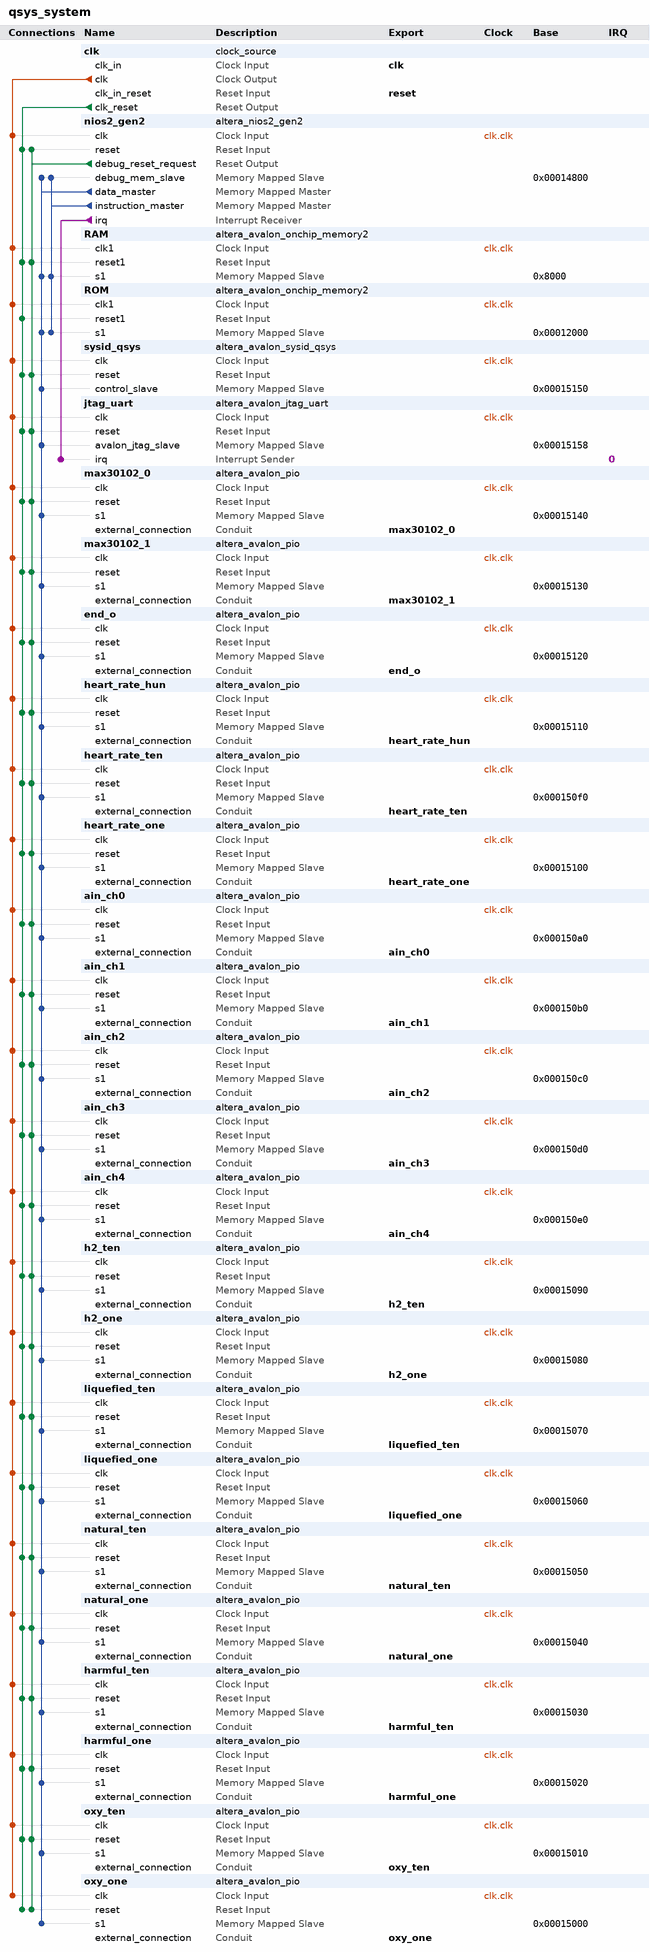
[diagram p0: system contents]
# Platform Designer (Qsys) system qsys_system, Cyclone IV E EP4CE10F17C8
# Parameters at their usual value, and those the tool derives, are not listed.
package require -exact qsys 18.1
create_system qsys_system
set_project_property DEVICE_FAMILY {Cyclone IV E}
set_project_property DEVICE EP4CE10F17C8

add_instance clk clock_source 18.1
set_instance_parameter_value clk clockFrequency 50000000

add_instance nios2_gen2 altera_nios2_gen2 18.1
set_instance_parameter_value nios2_gen2 dcache_size 2048
set_instance_parameter_value nios2_gen2 exceptionSlave RAM.s1
set_instance_parameter_value nios2_gen2 icache_size 4096
set_instance_parameter_value nios2_gen2 impl Tiny
set_instance_parameter_value nios2_gen2 resetSlave ROM.s1

add_instance RAM altera_avalon_onchip_memory2 18.1
set_instance_parameter_value RAM dataWidth 32
set_instance_parameter_value RAM dualPort false
set_instance_parameter_value RAM initMemContent true
set_instance_parameter_value RAM initializationFileName E:/2019GEDC/CODE_Project/Cyclone_IV/FAMS/software/Data_Process/mem_init/qsys_system_RAM.hex
set_instance_parameter_value RAM memorySize 20480
set_instance_parameter_value RAM useNonDefaultInitFile true

add_instance ROM altera_avalon_onchip_memory2 18.1
set_instance_parameter_value ROM dataWidth 32
set_instance_parameter_value ROM dualPort false
set_instance_parameter_value ROM initMemContent true
set_instance_parameter_value ROM initializationFileName E:/2019GEDC/CODE_Project/Cyclone_IV/FAMS/software/Data_Process/mem_init/qsys_system_ROM.hex
set_instance_parameter_value ROM memorySize 8192
set_instance_parameter_value ROM useNonDefaultInitFile true
set_instance_parameter_value ROM writable false

add_instance sysid_qsys altera_avalon_sysid_qsys 18.1
set_instance_parameter_value sysid_qsys id 0

add_instance jtag_uart altera_avalon_jtag_uart 18.1
set_instance_parameter_value jtag_uart simInteractiveOptions NO_INTERACTIVE_WINDOWS

add_instance max30102_0 altera_avalon_pio 18.1
set_instance_parameter_value max30102_0 direction Input
set_instance_parameter_value max30102_0 width 24

add_instance max30102_1 altera_avalon_pio 18.1
set_instance_parameter_value max30102_1 direction Input
set_instance_parameter_value max30102_1 width 24

add_instance end_o altera_avalon_pio 18.1
set_instance_parameter_value end_o direction Input
set_instance_parameter_value end_o width 1

add_instance heart_rate_hun altera_avalon_pio 18.1
set_instance_parameter_value heart_rate_hun direction Output
set_instance_parameter_value heart_rate_hun width 4

add_instance heart_rate_ten altera_avalon_pio 18.1
set_instance_parameter_value heart_rate_ten direction Output
set_instance_parameter_value heart_rate_ten width 4

add_instance heart_rate_one altera_avalon_pio 18.1
set_instance_parameter_value heart_rate_one direction Output
set_instance_parameter_value heart_rate_one width 4

add_instance ain_ch0 altera_avalon_pio 18.1
set_instance_parameter_value ain_ch0 direction Input
set_instance_parameter_value ain_ch0 width 12

add_instance ain_ch1 altera_avalon_pio 18.1
set_instance_parameter_value ain_ch1 direction Input
set_instance_parameter_value ain_ch1 width 12

add_instance ain_ch2 altera_avalon_pio 18.1
set_instance_parameter_value ain_ch2 direction Input
set_instance_parameter_value ain_ch2 width 12

add_instance ain_ch3 altera_avalon_pio 18.1
set_instance_parameter_value ain_ch3 direction Input
set_instance_parameter_value ain_ch3 width 12

add_instance ain_ch4 altera_avalon_pio 18.1
set_instance_parameter_value ain_ch4 direction Input
set_instance_parameter_value ain_ch4 width 12

add_instance h2_ten altera_avalon_pio 18.1
set_instance_parameter_value h2_ten direction Output
set_instance_parameter_value h2_ten width 4

add_instance h2_one altera_avalon_pio 18.1
set_instance_parameter_value h2_one direction Output
set_instance_parameter_value h2_one width 4

add_instance liquefied_ten altera_avalon_pio 18.1
set_instance_parameter_value liquefied_ten direction Output
set_instance_parameter_value liquefied_ten width 4

add_instance liquefied_one altera_avalon_pio 18.1
set_instance_parameter_value liquefied_one direction Output
set_instance_parameter_value liquefied_one width 4

add_instance natural_ten altera_avalon_pio 18.1
set_instance_parameter_value natural_ten direction Output
set_instance_parameter_value natural_ten width 4

add_instance natural_one altera_avalon_pio 18.1
set_instance_parameter_value natural_one direction Output
set_instance_parameter_value natural_one width 4

add_instance harmful_ten altera_avalon_pio 18.1
set_instance_parameter_value harmful_ten direction Output
set_instance_parameter_value harmful_ten width 4

add_instance harmful_one altera_avalon_pio 18.1
set_instance_parameter_value harmful_one direction Output
set_instance_parameter_value harmful_one width 4

add_instance oxy_ten altera_avalon_pio 18.1
set_instance_parameter_value oxy_ten direction Output
set_instance_parameter_value oxy_ten width 4

add_instance oxy_one altera_avalon_pio 18.1
set_instance_parameter_value oxy_one direction Output
set_instance_parameter_value oxy_one width 4

# connections
add_connection clk.clk ain_ch0.clk clock
add_connection clk.clk ain_ch1.clk clock
add_connection clk.clk ain_ch2.clk clock
add_connection clk.clk ain_ch3.clk clock
add_connection clk.clk ain_ch4.clk clock
add_connection clk.clk end_o.clk clock
add_connection clk.clk h2_one.clk clock
add_connection clk.clk h2_ten.clk clock
add_connection clk.clk harmful_one.clk clock
add_connection clk.clk harmful_ten.clk clock
add_connection clk.clk heart_rate_hun.clk clock
add_connection clk.clk heart_rate_one.clk clock
add_connection clk.clk heart_rate_ten.clk clock
add_connection clk.clk jtag_uart.clk clock
add_connection clk.clk liquefied_one.clk clock
add_connection clk.clk liquefied_ten.clk clock
add_connection clk.clk max30102_0.clk clock
add_connection clk.clk max30102_1.clk clock
add_connection clk.clk natural_one.clk clock
add_connection clk.clk natural_ten.clk clock
add_connection clk.clk nios2_gen2.clk clock
add_connection clk.clk oxy_one.clk clock
add_connection clk.clk oxy_ten.clk clock
add_connection clk.clk RAM.clk1 clock
add_connection clk.clk ROM.clk1 clock
add_connection clk.clk sysid_qsys.clk clock
add_connection clk.clk_reset ain_ch0.reset reset
add_connection clk.clk_reset ain_ch1.reset reset
add_connection clk.clk_reset ain_ch2.reset reset
add_connection clk.clk_reset ain_ch3.reset reset
add_connection clk.clk_reset ain_ch4.reset reset
add_connection clk.clk_reset end_o.reset reset
add_connection clk.clk_reset h2_one.reset reset
add_connection clk.clk_reset h2_ten.reset reset
add_connection clk.clk_reset harmful_one.reset reset
add_connection clk.clk_reset harmful_ten.reset reset
add_connection clk.clk_reset heart_rate_hun.reset reset
add_connection clk.clk_reset heart_rate_one.reset reset
add_connection clk.clk_reset heart_rate_ten.reset reset
add_connection clk.clk_reset jtag_uart.reset reset
add_connection clk.clk_reset liquefied_one.reset reset
add_connection clk.clk_reset liquefied_ten.reset reset
add_connection clk.clk_reset max30102_0.reset reset
add_connection clk.clk_reset max30102_1.reset reset
add_connection clk.clk_reset natural_one.reset reset
add_connection clk.clk_reset natural_ten.reset reset
add_connection clk.clk_reset nios2_gen2.reset reset
add_connection clk.clk_reset oxy_one.reset reset
add_connection clk.clk_reset oxy_ten.reset reset
add_connection clk.clk_reset RAM.reset1 reset
add_connection clk.clk_reset ROM.reset1 reset
add_connection clk.clk_reset sysid_qsys.reset reset
add_connection nios2_gen2.debug_reset_request ain_ch0.reset reset
add_connection nios2_gen2.debug_reset_request ain_ch1.reset reset
add_connection nios2_gen2.debug_reset_request ain_ch2.reset reset
add_connection nios2_gen2.debug_reset_request ain_ch3.reset reset
add_connection nios2_gen2.debug_reset_request ain_ch4.reset reset
add_connection nios2_gen2.debug_reset_request end_o.reset reset
add_connection nios2_gen2.debug_reset_request h2_one.reset reset
add_connection nios2_gen2.debug_reset_request h2_ten.reset reset
add_connection nios2_gen2.debug_reset_request harmful_one.reset reset
add_connection nios2_gen2.debug_reset_request harmful_ten.reset reset
add_connection nios2_gen2.debug_reset_request heart_rate_hun.reset reset
add_connection nios2_gen2.debug_reset_request heart_rate_one.reset reset
add_connection nios2_gen2.debug_reset_request heart_rate_ten.reset reset
add_connection nios2_gen2.debug_reset_request jtag_uart.reset reset
add_connection nios2_gen2.debug_reset_request liquefied_one.reset reset
add_connection nios2_gen2.debug_reset_request liquefied_ten.reset reset
add_connection nios2_gen2.debug_reset_request max30102_0.reset reset
add_connection nios2_gen2.debug_reset_request max30102_1.reset reset
add_connection nios2_gen2.debug_reset_request natural_one.reset reset
add_connection nios2_gen2.debug_reset_request natural_ten.reset reset
add_connection nios2_gen2.debug_reset_request nios2_gen2.reset reset
add_connection nios2_gen2.debug_reset_request oxy_one.reset reset
add_connection nios2_gen2.debug_reset_request oxy_ten.reset reset
add_connection nios2_gen2.debug_reset_request RAM.reset1 reset
add_connection nios2_gen2.debug_reset_request sysid_qsys.reset reset
add_connection nios2_gen2.data_master ain_ch0.s1 avalon
set_connection_parameter_value nios2_gen2.data_master/ain_ch0.s1 baseAddress 0x000150a0
add_connection nios2_gen2.data_master ain_ch1.s1 avalon
set_connection_parameter_value nios2_gen2.data_master/ain_ch1.s1 baseAddress 0x000150b0
add_connection nios2_gen2.data_master ain_ch2.s1 avalon
set_connection_parameter_value nios2_gen2.data_master/ain_ch2.s1 baseAddress 0x000150c0
add_connection nios2_gen2.data_master ain_ch3.s1 avalon
set_connection_parameter_value nios2_gen2.data_master/ain_ch3.s1 baseAddress 0x000150d0
add_connection nios2_gen2.data_master ain_ch4.s1 avalon
set_connection_parameter_value nios2_gen2.data_master/ain_ch4.s1 baseAddress 0x000150e0
add_connection nios2_gen2.data_master end_o.s1 avalon
set_connection_parameter_value nios2_gen2.data_master/end_o.s1 baseAddress 0x00015120
add_connection nios2_gen2.data_master h2_one.s1 avalon
set_connection_parameter_value nios2_gen2.data_master/h2_one.s1 baseAddress 0x00015080
add_connection nios2_gen2.data_master h2_ten.s1 avalon
set_connection_parameter_value nios2_gen2.data_master/h2_ten.s1 baseAddress 0x00015090
add_connection nios2_gen2.data_master harmful_one.s1 avalon
set_connection_parameter_value nios2_gen2.data_master/harmful_one.s1 baseAddress 0x00015020
add_connection nios2_gen2.data_master harmful_ten.s1 avalon
set_connection_parameter_value nios2_gen2.data_master/harmful_ten.s1 baseAddress 0x00015030
add_connection nios2_gen2.data_master heart_rate_hun.s1 avalon
set_connection_parameter_value nios2_gen2.data_master/heart_rate_hun.s1 baseAddress 0x00015110
add_connection nios2_gen2.data_master heart_rate_one.s1 avalon
set_connection_parameter_value nios2_gen2.data_master/heart_rate_one.s1 baseAddress 0x00015100
add_connection nios2_gen2.data_master heart_rate_ten.s1 avalon
set_connection_parameter_value nios2_gen2.data_master/heart_rate_ten.s1 baseAddress 0x000150f0
add_connection nios2_gen2.data_master jtag_uart.avalon_jtag_slave avalon
set_connection_parameter_value nios2_gen2.data_master/jtag_uart.avalon_jtag_slave baseAddress 0x00015158
add_connection nios2_gen2.data_master liquefied_one.s1 avalon
set_connection_parameter_value nios2_gen2.data_master/liquefied_one.s1 baseAddress 0x00015060
add_connection nios2_gen2.data_master liquefied_ten.s1 avalon
set_connection_parameter_value nios2_gen2.data_master/liquefied_ten.s1 baseAddress 0x00015070
add_connection nios2_gen2.data_master max30102_0.s1 avalon
set_connection_parameter_value nios2_gen2.data_master/max30102_0.s1 baseAddress 0x00015140
add_connection nios2_gen2.data_master max30102_1.s1 avalon
set_connection_parameter_value nios2_gen2.data_master/max30102_1.s1 baseAddress 0x00015130
add_connection nios2_gen2.data_master natural_one.s1 avalon
set_connection_parameter_value nios2_gen2.data_master/natural_one.s1 baseAddress 0x00015040
add_connection nios2_gen2.data_master natural_ten.s1 avalon
set_connection_parameter_value nios2_gen2.data_master/natural_ten.s1 baseAddress 0x00015050
add_connection nios2_gen2.data_master nios2_gen2.debug_mem_slave avalon
set_connection_parameter_value nios2_gen2.data_master/nios2_gen2.debug_mem_slave baseAddress 0x00014800
add_connection nios2_gen2.data_master oxy_one.s1 avalon
set_connection_parameter_value nios2_gen2.data_master/oxy_one.s1 baseAddress 0x00015000
add_connection nios2_gen2.data_master oxy_ten.s1 avalon
set_connection_parameter_value nios2_gen2.data_master/oxy_ten.s1 baseAddress 0x00015010
add_connection nios2_gen2.data_master RAM.s1 avalon
set_connection_parameter_value nios2_gen2.data_master/RAM.s1 baseAddress 0x8000
add_connection nios2_gen2.data_master ROM.s1 avalon
set_connection_parameter_value nios2_gen2.data_master/ROM.s1 baseAddress 0x00012000
add_connection nios2_gen2.data_master sysid_qsys.control_slave avalon
set_connection_parameter_value nios2_gen2.data_master/sysid_qsys.control_slave baseAddress 0x00015150
add_connection nios2_gen2.instruction_master nios2_gen2.debug_mem_slave avalon
set_connection_parameter_value nios2_gen2.instruction_master/nios2_gen2.debug_mem_slave baseAddress 0x00014800
add_connection nios2_gen2.instruction_master RAM.s1 avalon
set_connection_parameter_value nios2_gen2.instruction_master/RAM.s1 baseAddress 0x8000
add_connection nios2_gen2.instruction_master ROM.s1 avalon
set_connection_parameter_value nios2_gen2.instruction_master/ROM.s1 baseAddress 0x00012000
add_connection nios2_gen2.irq jtag_uart.irq interrupt
set_connection_parameter_value nios2_gen2.irq/jtag_uart.irq irqNumber 0

# exported interfaces
add_interface ain_ch0 conduit end
set_interface_property ain_ch0 EXPORT_OF ain_ch0.external_connection
add_interface ain_ch1 conduit end
set_interface_property ain_ch1 EXPORT_OF ain_ch1.external_connection
add_interface ain_ch2 conduit end
set_interface_property ain_ch2 EXPORT_OF ain_ch2.external_connection
add_interface ain_ch3 conduit end
set_interface_property ain_ch3 EXPORT_OF ain_ch3.external_connection
add_interface ain_ch4 conduit end
set_interface_property ain_ch4 EXPORT_OF ain_ch4.external_connection
add_interface clk clock sink
set_interface_property clk EXPORT_OF clk.clk_in
add_interface end_o conduit end
set_interface_property end_o EXPORT_OF end_o.external_connection
add_interface h2_one conduit end
set_interface_property h2_one EXPORT_OF h2_one.external_connection
add_interface h2_ten conduit end
set_interface_property h2_ten EXPORT_OF h2_ten.external_connection
add_interface harmful_one conduit end
set_interface_property harmful_one EXPORT_OF harmful_one.external_connection
add_interface harmful_ten conduit end
set_interface_property harmful_ten EXPORT_OF harmful_ten.external_connection
add_interface heart_rate_hun conduit end
set_interface_property heart_rate_hun EXPORT_OF heart_rate_hun.external_connection
add_interface heart_rate_one conduit end
set_interface_property heart_rate_one EXPORT_OF heart_rate_one.external_connection
add_interface heart_rate_ten conduit end
set_interface_property heart_rate_ten EXPORT_OF heart_rate_ten.external_connection
add_interface liquefied_one conduit end
set_interface_property liquefied_one EXPORT_OF liquefied_one.external_connection
add_interface liquefied_ten conduit end
set_interface_property liquefied_ten EXPORT_OF liquefied_ten.external_connection
add_interface max30102_0 conduit end
set_interface_property max30102_0 EXPORT_OF max30102_0.external_connection
add_interface max30102_1 conduit end
set_interface_property max30102_1 EXPORT_OF max30102_1.external_connection
add_interface natural_one conduit end
set_interface_property natural_one EXPORT_OF natural_one.external_connection
add_interface natural_ten conduit end
set_interface_property natural_ten EXPORT_OF natural_ten.external_connection
add_interface oxy_one conduit end
set_interface_property oxy_one EXPORT_OF oxy_one.external_connection
add_interface oxy_ten conduit end
set_interface_property oxy_ten EXPORT_OF oxy_ten.external_connection
add_interface reset reset sink
set_interface_property reset EXPORT_OF clk.clk_in_reset

set_interconnect_requirement {$system} qsys_mm.clockCrossingAdapter HANDSHAKE
set_interconnect_requirement {$system} qsys_mm.enableEccProtection FALSE
set_interconnect_requirement {$system} qsys_mm.insertDefaultSlave FALSE
set_interconnect_requirement {$system} qsys_mm.maxAdditionalLatency 1

save_system qsys_system.qsys
